# Altium schematic sheet MCU-BLE.SchDoc
size 431 x 304 mm; SheetNumber: 6; SheetTotal: 17
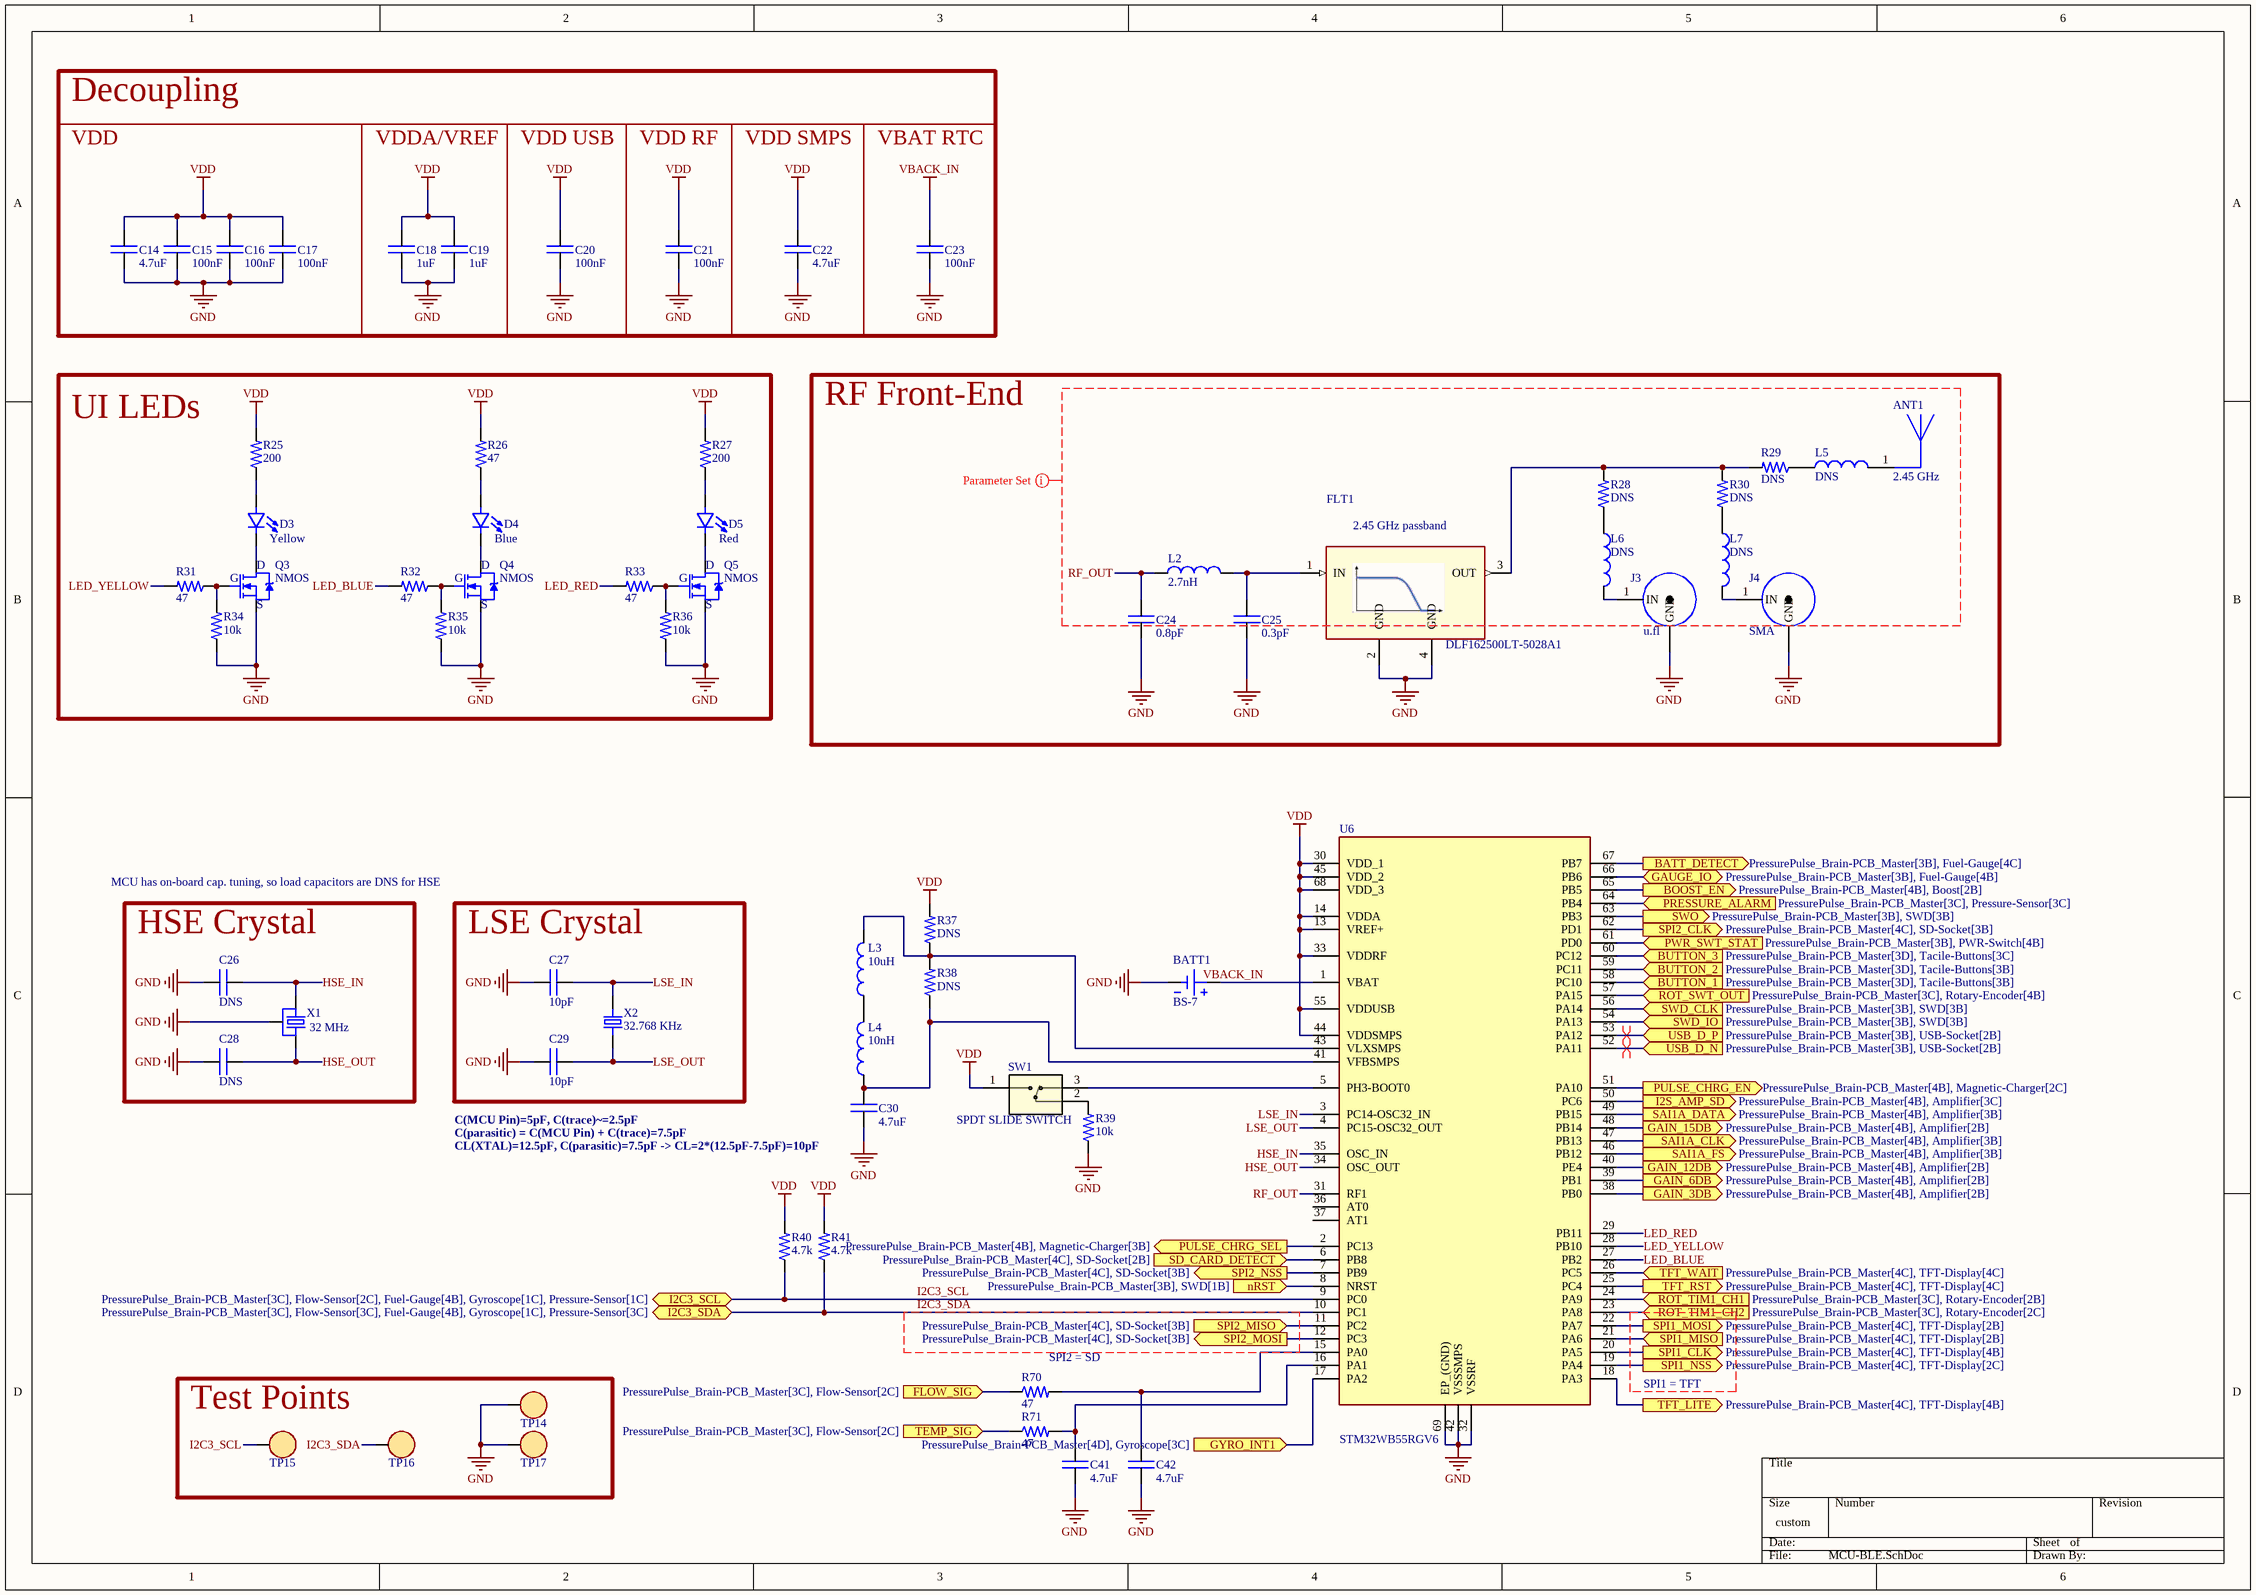
[diagram p0: MCU-BLE.SchDoc]

## Parts
ANT1  Center Frequency: 2.45 GHz  [ANT_ANT7020LL05R0870A_PUL-L]  (hidden comment: CHIP ANTENNA)
BATT1  BS-7  [BAT_BS-7]
C14  value 4.7uF  [0402C]  (hidden comment: CAP)
C15  value 100nF  [0402C]  (hidden comment: CAP)
C16  value 100nF  [0402C]  (hidden comment: CAP)
C17  value 100nF  [0402C]  (hidden comment: CAP)
C18  value 1uF  [0402C]  (hidden comment: CAP)
C19  value 1uF  [0402C]  (hidden comment: CAP)
C20  value 100nF  [0402C]  (hidden comment: CAP)
C21  value 100nF  [0402C]  (hidden comment: CAP)
C22  value 4.7uF  [0402C]  (hidden comment: CAP)
C23  value 100nF  [0402C]  (hidden comment: CAP)
C24  value 0.8pF  [0603C]  (hidden comment: CAP)
C25  value 0.3pF  [0402C]  (hidden comment: CAP)
C26  value DNS  [0402C]  (hidden comment: CAP)
C27  value 10pF  [0402C]  (hidden comment: CAP)
C28  value DNS  [0402C]  (hidden comment: CAP)
C29  value 10pF  [0402C]  (hidden comment: CAP)
C30  value 4.7uF  [0402C]  (hidden comment: CAP)
C41  value 4.7uF  [0402C]  (hidden comment: CAP)
C42  value 4.7uF  [0402C]  (hidden comment: CAP)
D3  Color: Yellow  [0603-LED]  (hidden comment: LED - single)
D4  Color: Blue  [0603-LED]  (hidden comment: LED - single)
D5  Color: Red  [0603-LED]  (hidden comment: LED - single)
FLT1  DLF162500LT-5028A1  [DLF-4_1P6X0P8]
J3  u.fl  [U.FL]
J4  SMA  [SMA TH RA]
L2  value 2.7nH  [0402L]  (hidden comment: IND)
L3  value 10uH  [0805L]  (hidden comment: IND)
L4  value 10nH  [0402L]  (hidden comment: IND)
L5  value DNS  [0402L]  (hidden comment: IND)
L6  value DNS  [0402L]  (hidden comment: IND)
L7  value DNS  [0402L]  (hidden comment: IND)
Q3  NMOS  [SOT-23]
Q4  NMOS  [SOT-23]
Q5  NMOS  [SOT-23]
R25  value 200  [0402R]  (hidden comment: RES)
R26  value 47  [0402R]  (hidden comment: RES)
R27  value 200  [0402R]  (hidden comment: RES)
R28  value DNS  [0402R]  (hidden comment: RES)
R29  value DNS  [0402R]  (hidden comment: RES)
R30  value DNS  [0402R]  (hidden comment: RES)
R31  value 47  [0402R]  (hidden comment: RES)
R32  value 47  [0402R]  (hidden comment: RES)
R33  value 47  [0402R]  (hidden comment: RES)
R34  value 10k  [0402R]  (hidden comment: RES)
R35  value 10k  [0402R]  (hidden comment: RES)
R36  value 10k  [0402R]  (hidden comment: RES)
R37  value DNS  [0402R]  (hidden comment: RES)
R38  value DNS  [0402R]  (hidden comment: RES)
R39  value 10k  [0402R]  (hidden comment: RES)
R40  value 4.7k  [0402R]  (hidden comment: RES)
R41  value 4.7k  [0402R]  (hidden comment: RES)
R70  value 47  [0402R]  (hidden comment: RES)
R71  value 47  [0402R]  (hidden comment: RES)
SW1  SPDT SLIDE SWITCH  [JS102011SCQN]
TP14  RH-5019  [TP - RH-5019]  (value not drawn)
TP15  RH-5019  [TP - RH-5019]  (value not drawn)
TP16  RH-5019  [TP - RH-5019]  (value not drawn)
TP17  RH-5019  [TP - RH-5019]  (value not drawn)
U6  STM32WB55RGV6  [VQFN-68]
X1  Frequency: 32 MHz  [32MHZ_SMD1612-4P]  (hidden comment: XTAL-OSC_32MHz)
X2  Frequency: 32.768 KHz  [XTAL_ECS-.327-12.5-34B-TR]  (hidden comment: XTAL-OSC_32.768kHz)

## Blocks framed on the sheet
Decoupling: C14-C17
VDDA/VREF: C18 C19
VDD USB: C20
VDD RF: C21
VDD SMPS: C22
VBAT RTC: C23
UI LEDs: D3-D5 Q3-Q5 R25-R27 R31-R36
RF Front-End: ANT1 C24 C25 FLT1 J3 J4 L2 L5-L7 R28-R30
HSE Crystal: C26 C28 X1
LSE Crystal: C27 C29 X2
Test Points: TP14-TP17

## Ports
BATT_DETECT (out, see PressurePulse_Brain-PCB_Master[3B], Fuel-Gauge[4C]), BOOST_EN (out, see PressurePulse_Brain-PCB_Master[4B], Boost[2B]), BUTTON_1 (in, see PressurePulse_Brain-PCB_Master[3D], Tacile-Buttons[3B]), BUTTON_2 (in, see PressurePulse_Brain-PCB_Master[3D], Tacile-Buttons[3B]), BUTTON_3 (in, see PressurePulse_Brain-PCB_Master[3D], Tacile-Buttons[3C]), FLOW_SIG (in, see PressurePulse_Brain-PCB_Master[3C], Flow-Sensor[2C]), GAIN_3DB (out, see PressurePulse_Brain-PCB_Master[4B], Amplifier[2B]), GAIN_6DB (out, see PressurePulse_Brain-PCB_Master[4B], Amplifier[2B]), GAIN_12DB (out, see PressurePulse_Brain-PCB_Master[4B], Amplifier[2B]), GAIN_15DB (out, see PressurePulse_Brain-PCB_Master[4B], Amplifier[2B]), GAUGE_IO (bidir, see PressurePulse_Brain-PCB_Master[3B], Fuel-Gauge[4B]), GYRO_INT1 (in, see PressurePulse_Brain-PCB_Master[4D], Gyroscope[3C]), I2C3_SCL (bidir, see PressurePulse_Brain-PCB_Master[3C], Flow-Sensor[2C], Fuel-Gauge[4B], Gyroscope[1C], Pressure-Sensor[1C]), I2C3_SDA (bidir, see PressurePulse_Brain-PCB_Master[3C], Flow-Sensor[3C], Fuel-Gauge[4B], Gyroscope[1C], Pressure-Sensor[3C]), I2S_AMP_SD (out, see PressurePulse_Brain-PCB_Master[4B], Amplifier[3C]), nRST (in, see PressurePulse_Brain-PCB_Master[3B], SWD[1B]), PRESSURE_ALARM (in, see PressurePulse_Brain-PCB_Master[3C], Pressure-Sensor[3C]), PULSE_CHRG_EN (out, see PressurePulse_Brain-PCB_Master[4B], Magnetic-Charger[2C]), PULSE_CHRG_SEL (out, see PressurePulse_Brain-PCB_Master[4B], Magnetic-Charger[3B]), PWR_SWT_STAT (in, see PressurePulse_Brain-PCB_Master[3B], PWR-Switch[4B]), ROT_SWT_OUT (in, see PressurePulse_Brain-PCB_Master[3C], Rotary-Encoder[4B]), ROT_TIM1_CH1 (in, see PressurePulse_Brain-PCB_Master[3C], Rotary-Encoder[2B]), ROT_TIM1_CH2 (in, see PressurePulse_Brain-PCB_Master[3C], Rotary-Encoder[2C]), SAI1A_CLK (out, see PressurePulse_Brain-PCB_Master[4B], Amplifier[3B]), SAI1A_DATA (out, see PressurePulse_Brain-PCB_Master[4B], Amplifier[3B]), SAI1A_FS (out, see PressurePulse_Brain-PCB_Master[4B], Amplifier[3B]), SD_CARD_DETECT (in, see PressurePulse_Brain-PCB_Master[4C], SD-Socket[2B]), SPI1_CLK (out, see PressurePulse_Brain-PCB_Master[4C], TFT-Display[4B]), SPI1_MISO (in, see PressurePulse_Brain-PCB_Master[4C], TFT-Display[2B]), SPI1_MOSI (out, see PressurePulse_Brain-PCB_Master[4C], TFT-Display[2B]), SPI1_NSS (out, see PressurePulse_Brain-PCB_Master[4C], TFT-Display[2C]), SPI2_CLK (out, see PressurePulse_Brain-PCB_Master[4C], SD-Socket[3B]), SPI2_MISO (in, see PressurePulse_Brain-PCB_Master[4C], SD-Socket[3B]), SPI2_MOSI (out, see PressurePulse_Brain-PCB_Master[4C], SD-Socket[3B]), SPI2_NSS (out, see PressurePulse_Brain-PCB_Master[4C], SD-Socket[3B]), SWD_CLK (in, see PressurePulse_Brain-PCB_Master[3B], SWD[3B]), SWD_IO (in, see PressurePulse_Brain-PCB_Master[3B], SWD[3B]), SWO (out, see PressurePulse_Brain-PCB_Master[3B], SWD[3B]), TEMP_SIG (in, see PressurePulse_Brain-PCB_Master[3C], Flow-Sensor[2C]), TFT_LITE (out, see PressurePulse_Brain-PCB_Master[4C], TFT-Display[4B]), TFT_RST (out, see PressurePulse_Brain-PCB_Master[4C], TFT-Display[4C]), TFT_WAIT (in, see PressurePulse_Brain-PCB_Master[4C], TFT-Display[4C]), USB_D_N (in, see PressurePulse_Brain-PCB_Master[3B], USB-Socket[2B]), USB_D_P (in, see PressurePulse_Brain-PCB_Master[3B], USB-Socket[2B])

## Nets
GND: BATT1.2(NEG) C14.1 C15.1 C16.1 C17.1 C18.1 C19.1 C20.1 C21.1 C22.1 C23.1 C24.1 C25.1 C26.2 C27.2 C28.2 C29.2 C30.1 C41.1 C42.1 FLT1.2(GND) FLT1.4(GND) J3.GND J4.GND Q3.S Q4.S Q5.S R34.1 R35.1 R36.1 R39.1 TP14.1 TP17.1 U6.32(VSSRF) U6.42(VSSSMPS) U6.69(EP_(GND)) X1.GND
VBACK_IN: BATT1.1(POS) C23.2 U6.1(VBAT)
VDD: C14.2 C15.2 C16.2 C17.2 C18.2 C19.2 C20.2 C21.2 C22.2 R25.2 R26.2 R27.2 R37.2 R40.2 R41.2 SW1.1 U6.13(VREF+) U6.14(VDDA) U6.30(VDD_1) U6.33(VDDRF) U6.44(VDDSMPS) U6.45(VDD_2) U6.55(VDDUSB) U6.68(VDD_3)
BATT_DETECT: U6.67(PB7) ; port BATT_DETECT
BOOST_EN: U6.65(PB5) ; port BOOST_EN
BUTTON_1: U6.58(PC10) ; port BUTTON_1
BUTTON_2: U6.59(PC11) ; port BUTTON_2
BUTTON_3: U6.60(PC12) ; port BUTTON_3
FLOW_SIG: R70.1 ; port FLOW_SIG
GAIN_3DB: U6.38(PB0) ; port GAIN_3DB
GAIN_6DB: U6.39(PB1) ; port GAIN_6DB
GAIN_12DB: U6.40(PE4) ; port GAIN_12DB
GAIN_15DB: U6.48(PB14) ; port GAIN_15DB
GAUGE_IO: U6.66(PB6) ; port GAUGE_IO
GYRO_INT1: U6.17(PA2) ; port GYRO_INT1
HSE_IN: C26.1 U6.35(OSC_IN) X1.1
HSE_OUT: C28.1 U6.34(OSC_OUT) X1.3
I2C3_SCL: R40.1 TP15.1 U6.9(PC0) ; port I2C3_SCL
I2C3_SDA: R41.1 TP16.1 U6.10(PC1) ; port I2C3_SDA
I2S_AMP_SD: U6.50(PC6) ; port I2S_AMP_SD
LED_BLUE: R32.2 U6.27(PB2)
LED_RED: R33.2 U6.29(PB11)
LED_YELLOW: R31.2 U6.28(PB10)
LSE_IN: C27.1 U6.3(PC14-OSC32_IN) X2.2
LSE_OUT: C29.1 U6.4(PC15-OSC32_OUT) X2.1
nRST: U6.8(NRST) ; port nRST
PRESSURE_ALARM: U6.64(PB4) ; port PRESSURE_ALARM
PULSE_CHRG_EN: U6.51(PA10) ; port PULSE_CHRG_EN
PULSE_CHRG_SEL: U6.2(PC13) ; port PULSE_CHRG_SEL
PWR_SWT_STAT: U6.61(PD0) ; port PWR_SWT_STAT
RF_OUT: C24.2 L2.1 U6.31(RF1)
ROT_SWT_OUT: U6.57(PA15) ; port ROT_SWT_OUT
ROT_TIM1_CH1: U6.24(PA9) ; port ROT_TIM1_CH1
ROT_TIM1_CH2: U6.23(PA8) ; port ROT_TIM1_CH2
SAI1A_CLK: U6.47(PB13) ; port SAI1A_CLK
SAI1A_DATA: U6.49(PB15) ; port SAI1A_DATA
SAI1A_FS: U6.46(PB12) ; port SAI1A_FS
SD_CARD_DETECT: U6.6(PB8) ; port SD_CARD_DETECT
SPI1_CLK: U6.20(PA5) ; port SPI1_CLK
SPI1_MISO: U6.21(PA6) ; port SPI1_MISO
SPI1_MOSI: U6.22(PA7) ; port SPI1_MOSI
SPI1_NSS: U6.19(PA4) ; port SPI1_NSS
SPI2_CLK: U6.62(PD1) ; port SPI2_CLK
SPI2_MISO: U6.11(PC2) ; port SPI2_MISO
SPI2_MOSI: U6.12(PC3) ; port SPI2_MOSI
SPI2_NSS: U6.7(PB9) ; port SPI2_NSS
SWD_CLK: U6.56(PA14) ; port SWD_CLK
SWD_IO: U6.54(PA13) ; port SWD_IO
SWO: U6.63(PB3) ; port SWO
TEMP_SIG: R71.1 ; port TEMP_SIG
TFT_LITE: U6.18(PA3) ; port TFT_LITE
TFT_RST: U6.25(PC4) ; port TFT_RST
TFT_WAIT: U6.26(PC5) ; port TFT_WAIT
USB_D_N: U6.52(PA11) ; port USB_D_N
USB_D_P: U6.53(PA12) ; port USB_D_P
NetANT1_1: ANT1.1 L5.2
NetC25_2: C25.2 FLT1.1(IN) L2.2
NetC30_2: C30.2 L4.1 R38.1 U6.41(VFBSMPS)
NetC41_2: C41.2 R71.2 U6.16(PA1)
NetC42_2: C42.2 R70.2 U6.15(PA0)
NetD3_1: D3.1(A) R25.1
NetD3_2: D3.2(C) Q3.D
NetD4_1: D4.1(A) R26.1
NetD4_2: D4.2(C) Q4.D
NetD5_1: D5.1(A) R27.1
NetD5_2: D5.2(C) Q5.D
NetFLT1_3: FLT1.3(OUT) R28.2 R29.2 R30.2
NetJ3_1: J3.1(IN) L6.2
NetJ4_1: J4.1(IN) L7.2
NetL3_1: L3.1 L4.2
NetL3_2: L3.2 R37.1 R38.2 U6.43(VLXSMPS)
NetL5_1: L5.1 R29.1
NetL6_1: L6.1 R28.1
NetL7_1: L7.1 R30.1
NetQ3_G: Q3.G R31.1 R34.2
NetQ4_G: Q4.G R32.1 R35.2
NetQ5_G: Q5.G R33.1 R36.2
NetR39_2: R39.2 SW1.2
NetSW1_3: SW1.3 U6.5(PH3-BOOT0)

Not connected (* = marked no-connect by the designer): U6 36(AT0) 37(AT1)

## Layout directives
differential pair: USB_D_N, USB_D_P
net class RF: RF_OUT

## Notes on the sheet
- VDD
- MCU has on-board cap. tuning, so load capacitors are DNS for HSE
- (near C30) CL(XTAL)=12.5pF, C(parasitic)=7.5pF -> CL=2*(12.5pF-7.5pF)=10pF
- C(MCU Pin)=5pF, C(trace)~=2.5pF
- C(parasitic) = C(MCU Pin) + C(trace)=7.5pF
- (near R70) SPI2 = SD
- SPI1 = TFT
- (in symbol 2.45GHz LPF) 2.45 GHz passband

## Library data of the parts
ANT1 = CHIP ANTENNA: MFR: Pulse Electronics; MFR PN: ANT7020LL05R2400A; Value: DNS; JLCPCB PN: DNS
BATT1 = COIN CELL BATT: Battery Holder (Open) Coin, 20.0mm 1 Cell PC Pin; MP: BS-2-1; MF: Q&J; Value: BS-2-1; JLCPCB PN: C70376
C14-C23 C26 C28 C30 = CAP: Capaicitor; MFR: *; MFR PN: *
C24 C25 C41 C42 = CAP: Capacitor; MFR: *; MFR PN: *
  C24: JLCPCB PN: C907996; Footprint: 0603
  C25: JLCPCB PN: C2986289; Footprint: *
  C41 C42: JLCPCB PN: *; Footprint: *
C27 C29 = CAP: Capaicitor; MFR PN: FN15N100J500PNG; MFR: *; JLCPCB PN: C328913
D3 = LED - single: LED; Value: 19-213/Y2C-CQ2R2L/3T(CY); MFR: *; MFR PN: *; JLCPCB PN: C72038
D4 = LED - single: LED; Value: D-060306B1; MFR: *; MFR PN: *; JLCPCB PN: C118339
D5 = LED - single: LED; Value: KT-0603R; MFR: *; MFR PN: *; JLCPCB PN: C2286
FLT1 = 2.45GHz LPF: RF FILTER LOW PASS 2.45GHZ 0603; MFR: TDK; MFR PN: DLF162500LT-5028A1; Value: DLF162500LT-5028A1; JLCPCB PN: C531364
J3 = u.fl CONN: u.fl 50Ohm; MFR: HRS(Hirose); MFR PN: U.FL-R-SMT-1(80); Value: U.FL-R-SMT-1(80); JLCPCB PN: C88374
J4 = SMA: SMA 50Ohm; MFR: DreamLNK; MFR PN: SMA-KWE901; Value: SMA-KWE901; JLCPCB PN: C914553
L2-L7 = IND: INDUCTOR; Footprint: *
  L2: JLCPCB PN: C963981
  L4: JLCPCB PN: C963995
  L5-L7: JLCPCB PN: *
Q3-Q5 = NMOS: 100V 1.6A 1.3W 220mΩ@10V,1.6A N Channel SOT-23  MOSFETs ROHS; MFR: Infineon; Value: IRLML0100TRPBF; MFR PN: IRLML0100TRPBF; JLCPCB PN: C53658
R25-R41 R70 R71 = RES: Resistor; MFR PN: *; MFR: *
  R25-R27 R37 R38: Type: SMD
  R28-R33 R40 R41 R70 R71: JLCPCB PN: *
  R34-R36: JLCPCB PN: C843837
  R39: Type: SMD; JLCPCB PN: C843837
SW1 = SPDT SLIDE SWITCH: MFR: C&K; Value: JS102011SCQN; MFR PN: JS102011SCQN; Type: SMD; JLCPCB PN: C221661
TP14-TP17 = TEST POINT: MFR: ronghe; MFR PN: RH-5019; Value: RH-5019; JLCPCB PN: C5199800
U6 = STM32WB55RGV6: ARM Microcontrollers - MCU Ultra-low-power dual core Arm Cortex-M4 MCU 64 MHz, Cortex-M0 32MHz with 1 Mbyte Flash, BLE, 802.15.4, USB, LCD, AES-256; MFR: STMicroelectronics; Value: STM32WB55RGV6; JLCPCB PN: C401505
X1 = XTAL-OSC_32MHz: SMD Tuning Fork Crystal; MFR PN: Murata; Value: XRCMD32M000FXP50R0; Type: SMD; JLCPCB PN: C341820
X2 = XTAL-OSC_32.768kHz: 32.768kHz 12.5pF ±20ppm SMD3215-2P  Crystals ROHS; MFR: CITIZEN; MFR PN: CM315D32768DZFT; Value: CM315D32768DZFT; JLCPCB PN: C182057